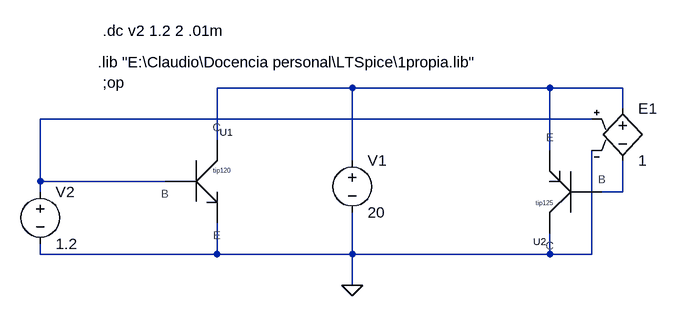
[diagram p0: schematic tip120 tip125 2.asc]
tip120 tip125 2.asc, the LTspice schematic file:
Version 4
SHEET 1 1288 680
WIRE 736 48 528 48
WIRE 1040 48 736 48
WIRE 1152 48 1040 48
WIRE 1152 80 1152 48
WIRE 1104 96 256 96
WIRE 528 128 528 48
WIRE 1040 144 1040 48
WIRE 736 160 736 48
WIRE 256 192 256 96
WIRE 448 192 256 192
WIRE 256 208 256 192
WIRE 1152 208 1152 160
WIRE 1152 208 1120 208
WIRE 256 304 256 288
WIRE 528 304 528 256
WIRE 528 304 256 304
WIRE 736 304 736 240
WIRE 736 304 528 304
WIRE 1040 304 1040 272
WIRE 1040 304 736 304
WIRE 1104 304 1104 144
WIRE 1104 304 1040 304
WIRE 736 352 736 304
FLAG 736 352 0
SYMBOL Propia\\Darlington\ npn 496 192 R0
SYMATTR Value tip120
SYMATTR InstName U1
SYMBOL voltage 736 144 R0
WINDOW 123 0 0 Left 0
WINDOW 39 0 0 Left 0
SYMATTR InstName V1
SYMATTR Value 20
SYMBOL Propia\\Darlington\ pnp 1072 208 R180
SYMATTR Value tip125
SYMATTR InstName U2
SYMBOL voltage 256 192 R0
WINDOW 123 0 0 Left 0
WINDOW 39 0 0 Left 0
SYMATTR InstName V2
SYMATTR Value 1.2
SYMBOL e 1152 64 R0
SYMATTR InstName E1
SYMATTR Value 1
TEXT 344 8 Left 2 !.lib "E:\\Claudio\\Docencia personal\\LTSpice\\1propia.lib"
TEXT 352 40 Left 2 !;op
TEXT 352 -40 Left 2 !.dc v2 1.2 2 .01m

The netlist it stands for:
* tip120 tip125 2.asc
XU1 N001 N002 0 tip120  ; pins C B E
V1 N001 0 20
XU2 0 N003 N001 tip125  ; pins C B E
V2 N002 0 1.2
E1 N001 N003 N002 0 1
.lib "E:\Claudio\Docencia personal\LTSpice\1propia.lib"
;op
.dc v2 1.2 2 .01m
.backanno
.end